# EAGLE schematic Motherboard (EAGLE 9.6.2)
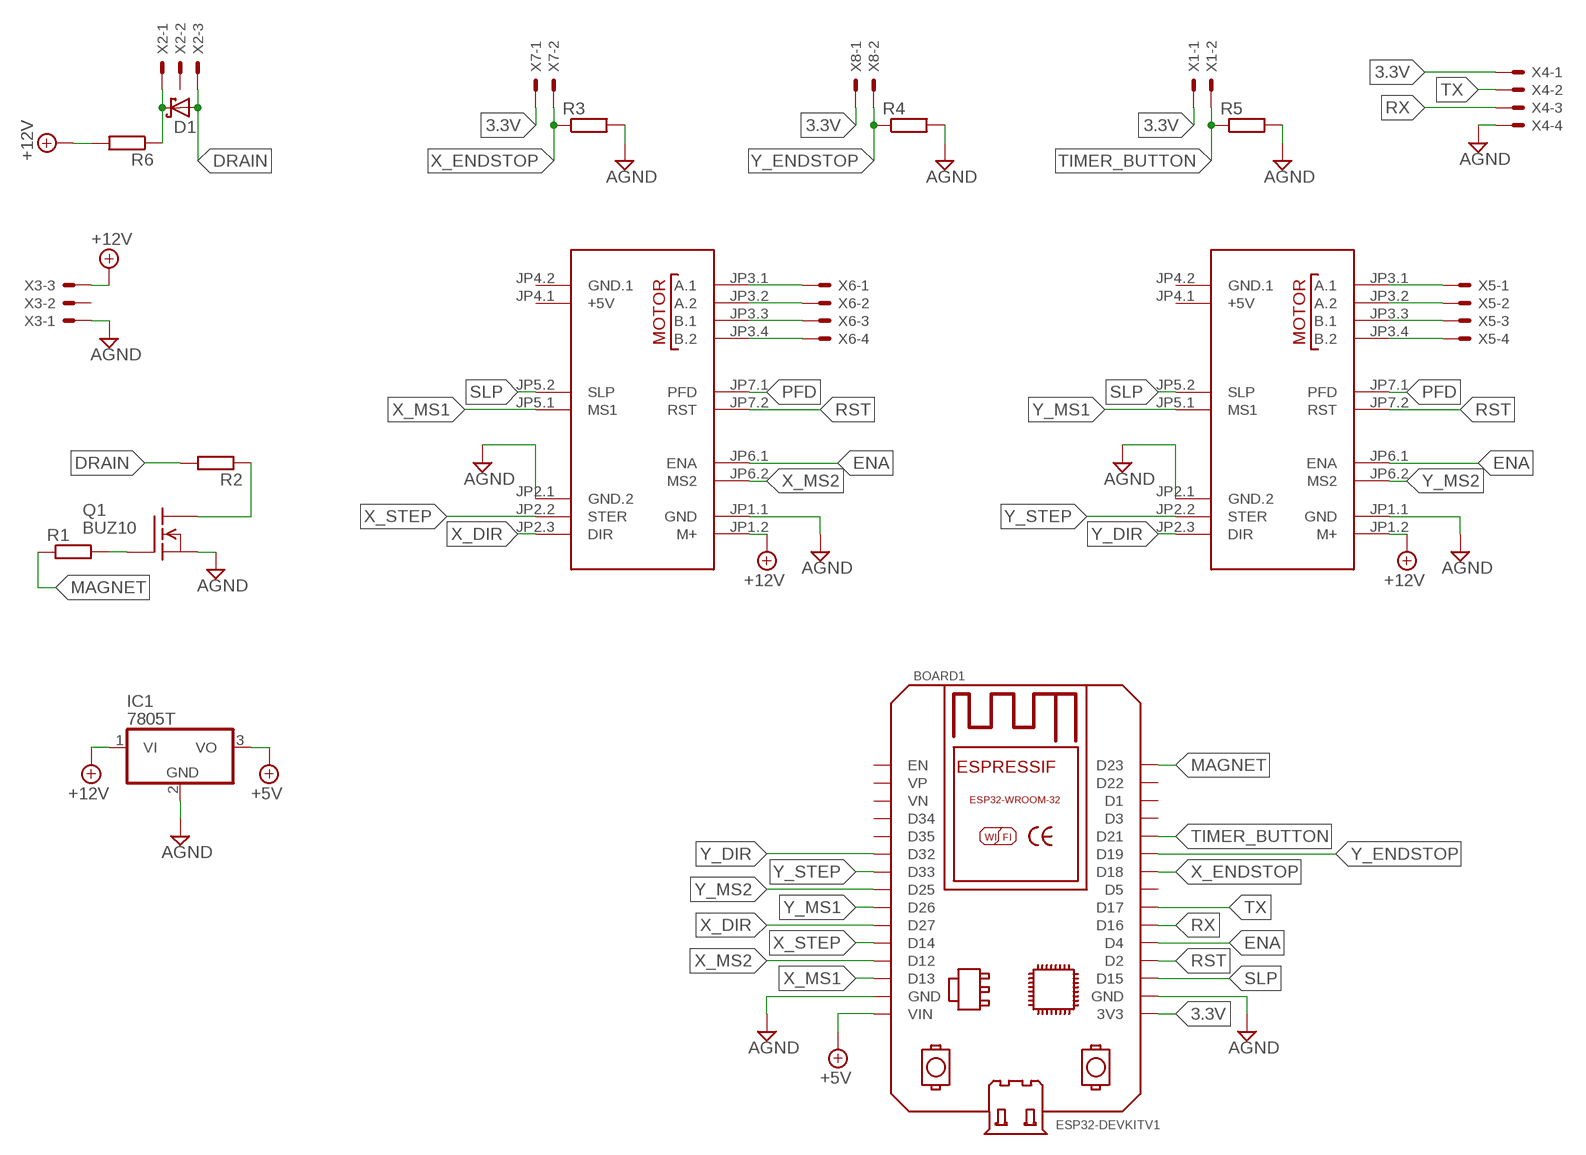
[diagram p0: schematic, sheet 1]

## Parts
BOARD1  ESP32DEVKITV1  [ESP32-DEVKITV1]
D1  SCHOTTKY-DIODECB417-15  [CB417-15]
IC1  7805T  [TO220H]
Q1  BUZ10  [TO220]
R1  R-EU_R0603  [R0603]
R2  R-EU_R0603  [R0603]
R3  R-EU_R0603  [R0603]
R4  R-EU_R0603  [R0603]
R5  R-EU_R0603  [R0603]
R6  R-EU_R0603  [R0603]
U$1  STEPPER-MOTOR-EASY-DRIVER  [STEPPER-MOTOR-EASY-DRIVER]
U$2  STEPPER-MOTOR-EASY-DRIVER  [STEPPER-MOTOR-EASY-DRIVER]
X1  22-23-2021  [22-23-2021]
X2  22-23-2031  [22-23-2031]
X3  22-23-2031  [22-23-2031]
X4  22-23-2041  [22-23-2041]
X5  22-23-2041  [22-23-2041]
X6  22-23-2041  [22-23-2041]
X7  22-23-2021  [22-23-2021]
X8  22-23-2021  [22-23-2021]

## Nets
3.3V: BOARD1.3V3 X1.1 X4.1 X7.1 X8.1
+5V: BOARD1.VIN IC1.3(VO)
+12V: IC1.1(VI) R6.2 U$1.JP1.2(M+) U$2.JP1.2(M+) X3.3
AGND: BOARD1.GND BOARD1.GND@1(GND) IC1.2(GND) Q1.3(S) R3.2 R4.2 R5.2 U$1.JP1.1(GND) U$1.JP2.1(GND.2) U$2.JP1.1(GND) U$2.JP2.1(GND.2) X3.1 X4.4
DRAIN: D1.A R2.2 X2.3
ENA: BOARD1.D4 U$1.JP6.1(ENA) U$2.JP6.1(ENA)
MAGNET: BOARD1.D23 R1.1
N$1: U$1.JP3.1(A.1) X6.1
N$2: U$1.JP3.2(A.2) X6.2
N$3: U$1.JP3.3(B.1) X6.3
N$4: U$1.JP3.4(B.2) X6.4
N$5: U$2.JP3.1(A.1) X5.1
N$6: U$2.JP3.2(A.2) X5.2
N$7: U$2.JP3.3(B.1) X5.3
N$8: U$2.JP3.4(B.2) X5.4
N$9: Q1.2(D) R2.1
N$10: Q1.1(G) R1.2
N$12: D1.C R6.1 X2.1
PFD: U$1.JP7.1(PFD) U$2.JP7.1(PFD)
RST: BOARD1.D2 U$1.JP7.2(RST) U$2.JP7.2(RST)
RX: BOARD1.D16 X4.3
SLP: BOARD1.D15 U$1.JP5.2(SLP) U$2.JP5.2(SLP)
TIMER_BUTTON: BOARD1.D21 R5.1 X1.2
TX: BOARD1.D17 X4.2
X_DIR: BOARD1.D27 U$1.JP2.3(DIR)
X_ENDSTOP: BOARD1.D18 R3.1 X7.2
X_MS1: BOARD1.D13 U$1.JP5.1(MS1)
X_MS2: BOARD1.D12 U$1.JP6.2(MS2)
X_STEP: BOARD1.D14 U$1.JP2.2(STER)
Y_DIR: BOARD1.D32 U$2.JP2.3(DIR)
Y_ENDSTOP: BOARD1.D19 R4.1 X8.2
Y_MS1: BOARD1.D26 U$2.JP5.1(MS1)
Y_MS2: BOARD1.D25 U$2.JP6.2(MS2)
Y_STEP: BOARD1.D33 U$2.JP2.2(STER)
Unconnected: BOARD1.D1 BOARD1.D3 BOARD1.D5 BOARD1.D22 BOARD1.D34 BOARD1.D35 BOARD1.EN BOARD1.VN BOARD1.VP U$1.JP4.1(+5V) U$1.JP4.2(GND.1) U$2.JP4.1(+5V) U$2.JP4.2(GND.1) X2.2 X3.2

## Library data of the parts
BOARD1 = ESP32-DEVKITV1:ESP32DEVKITV1: https://github.com/shridattdudhat
D1 = adafruit:SCHOTTKY-DIODE: Schottky Diode
IC1 = linear:78*: Positive VOLTAGE REGULATOR Source: http://cache.national.com/ds/LM/LM78L05.pdf http://www.fairchildsemi.com/ds/LM/LM7805.pdf
Q1 = transistor-fet:BUZ10: N-Channel Enhancement MOSFET 50V; 20A; 0,080Ohm
R1-R6 = rcl:R-EU_: RESISTOR, European symbol; SPICEPREFIX: R
U$1 U$2 = Ultrasonic Sensor:STEPPER-MOTOR-EASY-DRIVER: Stepper Motor Easy Driver Project page: http://www.schmalzhaus.com/EasyDriver/ Click here to find device on ebay.com <http://www.ebay.com/sch/easydriver+stepper+motor+driver>
X1 X7 X8 = con-molex:22-23-2021: .100" (2.54mm) Center Header - 2 Pin; MF: MOLEX; MPN: 22-23-2021; OC_FARNELL: 1462926; OC_NEWARK: 25C3832
X2 X3 = con-molex:22-23-2031: .100" (2.54mm) Center Header - 3 Pin; MF: MOLEX; MPN: 22-23-2031; OC_FARNELL: 1462950; OC_NEWARK: 30C0862
X4-X6 = con-molex:22-23-2041: .100" (2.54mm) Center Header - 4 Pin; MF: MOLEX; MPN: 22-23-2041; OC_FARNELL: 1462920; OC_NEWARK: 38C0355